# EAGLE design Data_Over_Power_Breakout (EAGLE 6.5.0)
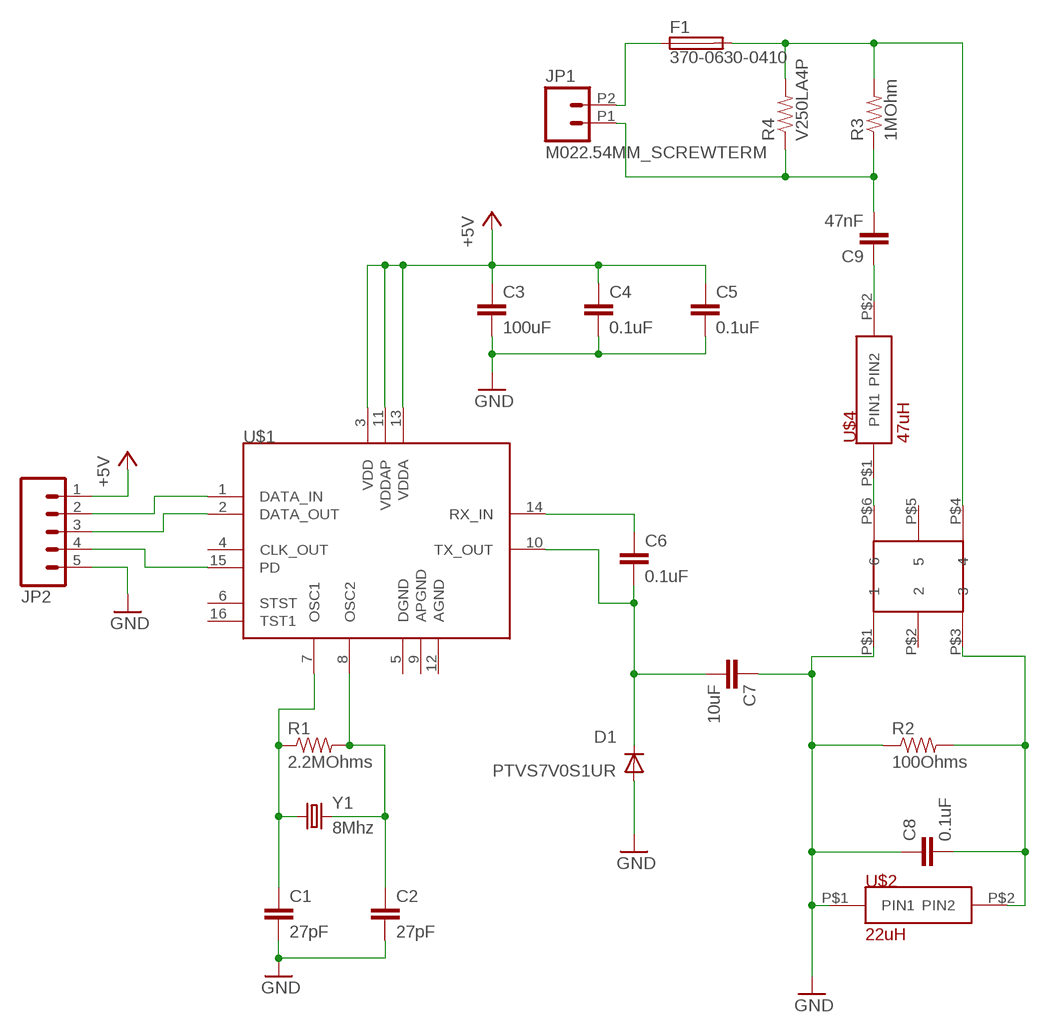
[diagram p0: schematic, sheet 1]

## Parts
C1  27pF  CAP1206  [1206]
C2  27pF  CAP1206  [1206]
C3  100uF  CAP1206  [1206]
C4  0.1uF  CAP1206  [1206]
C5  0.1uF  CAP1206  [1206]
C6  0.1uF  CAP_  [AXIAL-5MM]
C7  10uF  CAPPTH  [CAP-PTH-SMALL]
C8  0.1uF  CAP1206  [1206]
C9  47nF  C15/5  [C15B5]
D1  PTVS7V0S1UR  CGRM4001-G  [SOD-123_MINI-SMA]
F1  370-0630-0410  TR5  [TR5]
JP1  M022.54MM_SCREWTERM  [1X02_2.54_SCREWTERM]
JP2  M05PTH_LONGPADS  [1X05_LONGPADS]
R1  2.2MOhms  RESISTOR1206  [1206]
R2  100Ohms  RESISTORPTH-1/2W  [AXIAL-0.5]
R3  1MOhm  10KOHM1/6W5%(PTH)KIT  [AXIAL-0.3-KIT]
R4  V250LA4P  RESISTORPTH-1/4W  [AXIAL-0.4]
U$1  TDA5052AT  [SO16L]
U$2  22uH  RFB0807-220L  [RFB0807-220L]
U$3  78250MC  [78250MC]
U$4  47uH  RFB0807-220L  [RFB0807-220L]
Y1  8Mhz  CRYSTALHC49US  [HC49US]

## Nets
+5V: C3.1 C4.1 C5.1 JP2.1 U$1.3(VDD) U$1.11(VDDAP) U$1.13(VDDA)
GND: C1.2 C2.2 C3.2 C4.2 C5.2 C7.1 C8.1 D1.A JP2.5 R2.P$1 U$2.P$1(PIN1) U$3.P$1
N$1: C2.1 R1.2 U$1.8(OSC2) Y1.2
N$2: C1.1 R1.1 U$1.7(OSC1) Y1.1
N$3: U$3.P$6 U$4.P$1(PIN1)
N$4: C8.2 R2.P$2 U$2.P$2(PIN2) U$3.P$3
N$5: C6.P$1 U$1.14(RX_IN)
N$6: C6.P$2 C7.2 D1.C U$1.10(TX_OUT)
N$7: C9.1 U$4.P$2(PIN2)
N$8: C9.2 JP1.P1 R3.P$1 R4.P$1
N$9: F1.2 R3.P$2 R4.P$2 U$3.P$4
N$10: F1.1 JP1.P2
N$11: JP2.2 U$1.1(DATA_IN)
N$12: JP2.3 U$1.2(DATA_OUT)
N$13: JP2.4 U$1.15(PD)
Unconnected: U$1.4(CLK_OUT) U$1.5(DGND) U$1.6(STST) U$1.9(APGND) U$1.12(AGND) U$1.16(TST1) U$3.P$2 U$3.P$5

## Library data of the parts
C1-C6 C8 = SparkFun-Passives:CAP: Capacitor Standard 0603 ceramic capacitor, and 0.1" leaded capacitor.
C7 = SparkFun-Capacitors:CAP: Capacitor Standard 0603 ceramic capacitor, and 0.1" leaded capacitor.
C9 = capacitor-wima:C: CAPACITOR naming: grid - package width
D1 = diode:CGRM400*-G: Molded plasitc,JEDEC SOD-123/Mini SMA Source: Comchip CGRM4001-G.pdf
F1 = fuse:TR5: FUSE Wickmann; OC_FARNELL: unknown; OC_NEWARK: unknown
JP1 = SparkFun-Connectors:M02: Standard 2-pin 0.1" header. Use with - straight break away headers ( PRT-00116) - right angle break away headers (PRT-00553) - swiss pins (PRT-00743) - machine pins (PRT-00117) - female headers (PRT-00115) Molex polarized connector foot print use with: PRT-08233 with associated crimp pins and housings. 2.54_SCREWTERM for use with PRT-10571. 3.5mm Screw Terminal footprints for PRT-08084 5mm Screw Terminal footprints for use with PRT-08433
JP2 = SparkFun-Connectors:M05: Header 5 Standard 5-pin 0.1" header. Use with straight break away headers (SKU : PRT-00116), right angle break away headers (PRT-00553), swiss pins (PRT-00743), machine pins (PRT-00117), and female headers (PRT-00115). Molex polarized connector foot print use with SKU : PRT-08230 with associated crimp pins and housings.
R1 R4 = SparkFun-Passives:RESISTOR: Resistor Basic schematic elements and footprints for 0603, 1206, and PTH resistors.
R2 = SparkFun-Resistors:RESISTOR: Resistor Basic schematic elements and footprints for 0603, 1206, and PTH resistors.
R3 = SparkFun-Resistors:10KOHM1/6W5%(PTH): RES-08375; PROD_ID: RES-08375
U$1 = Power_Modem:TDA5052AT
U$2 U$4 = Coilcraft_Inductors:RFB0807-220L
U$3 = Murata_Transformers:78250MC
Y1 = SparkFun-FreqCtrl:CRYSTAL: Various standard crystals. Proven footprints. Spark Fun Electronics SKU : COM-00534

## Board
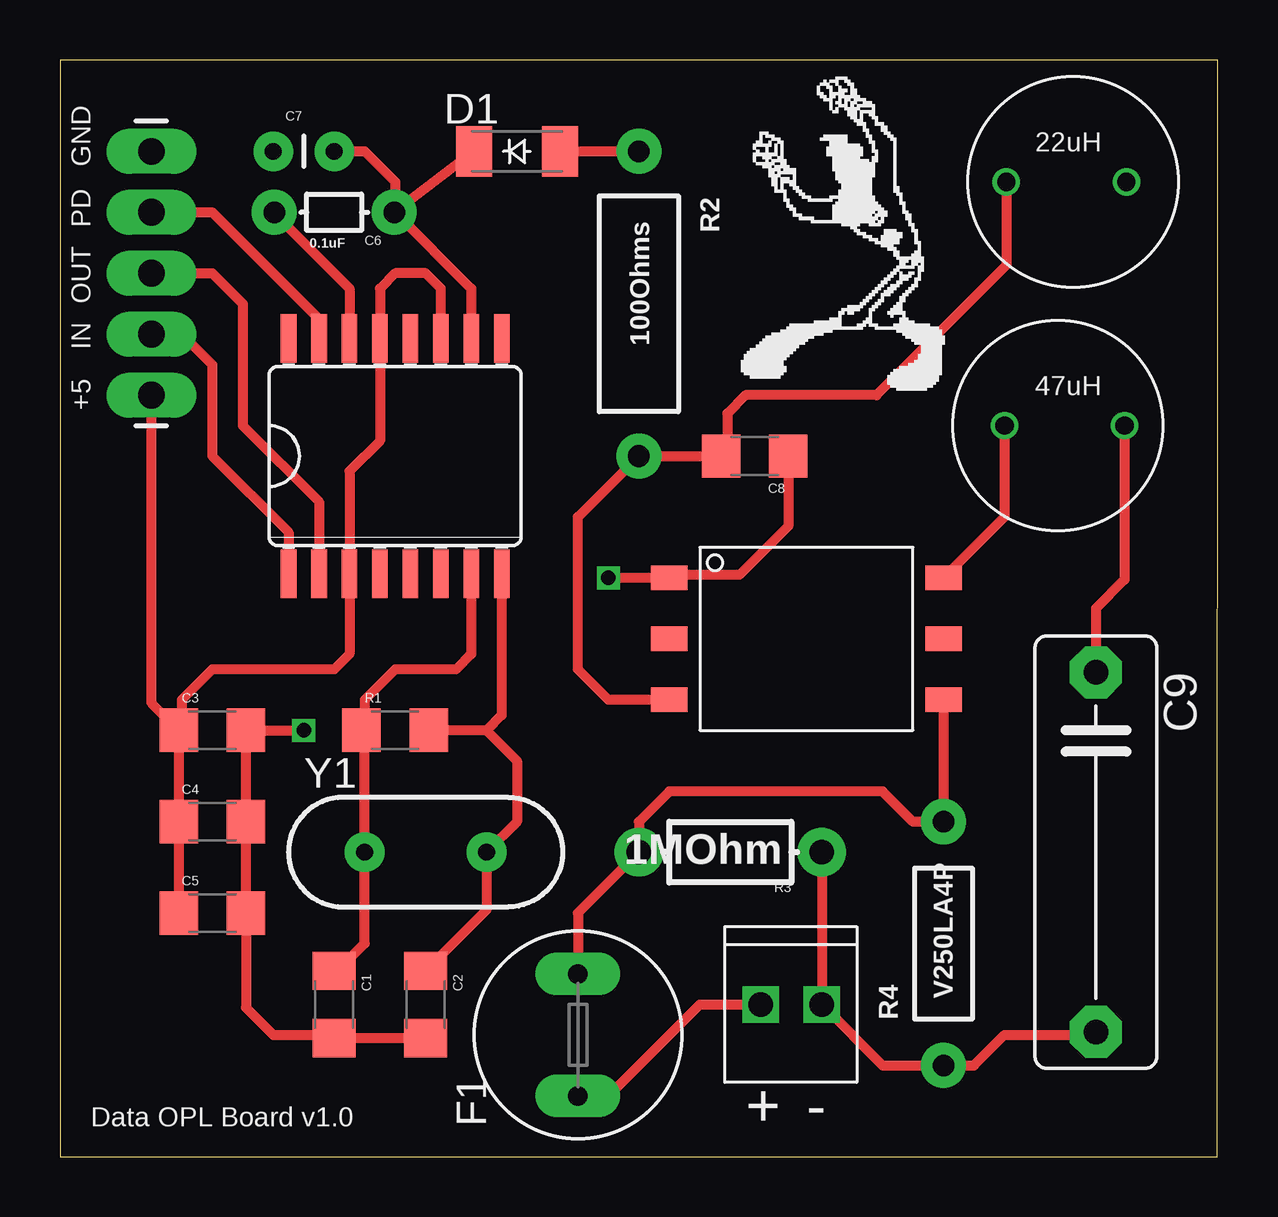
[diagram p1: board, top side]
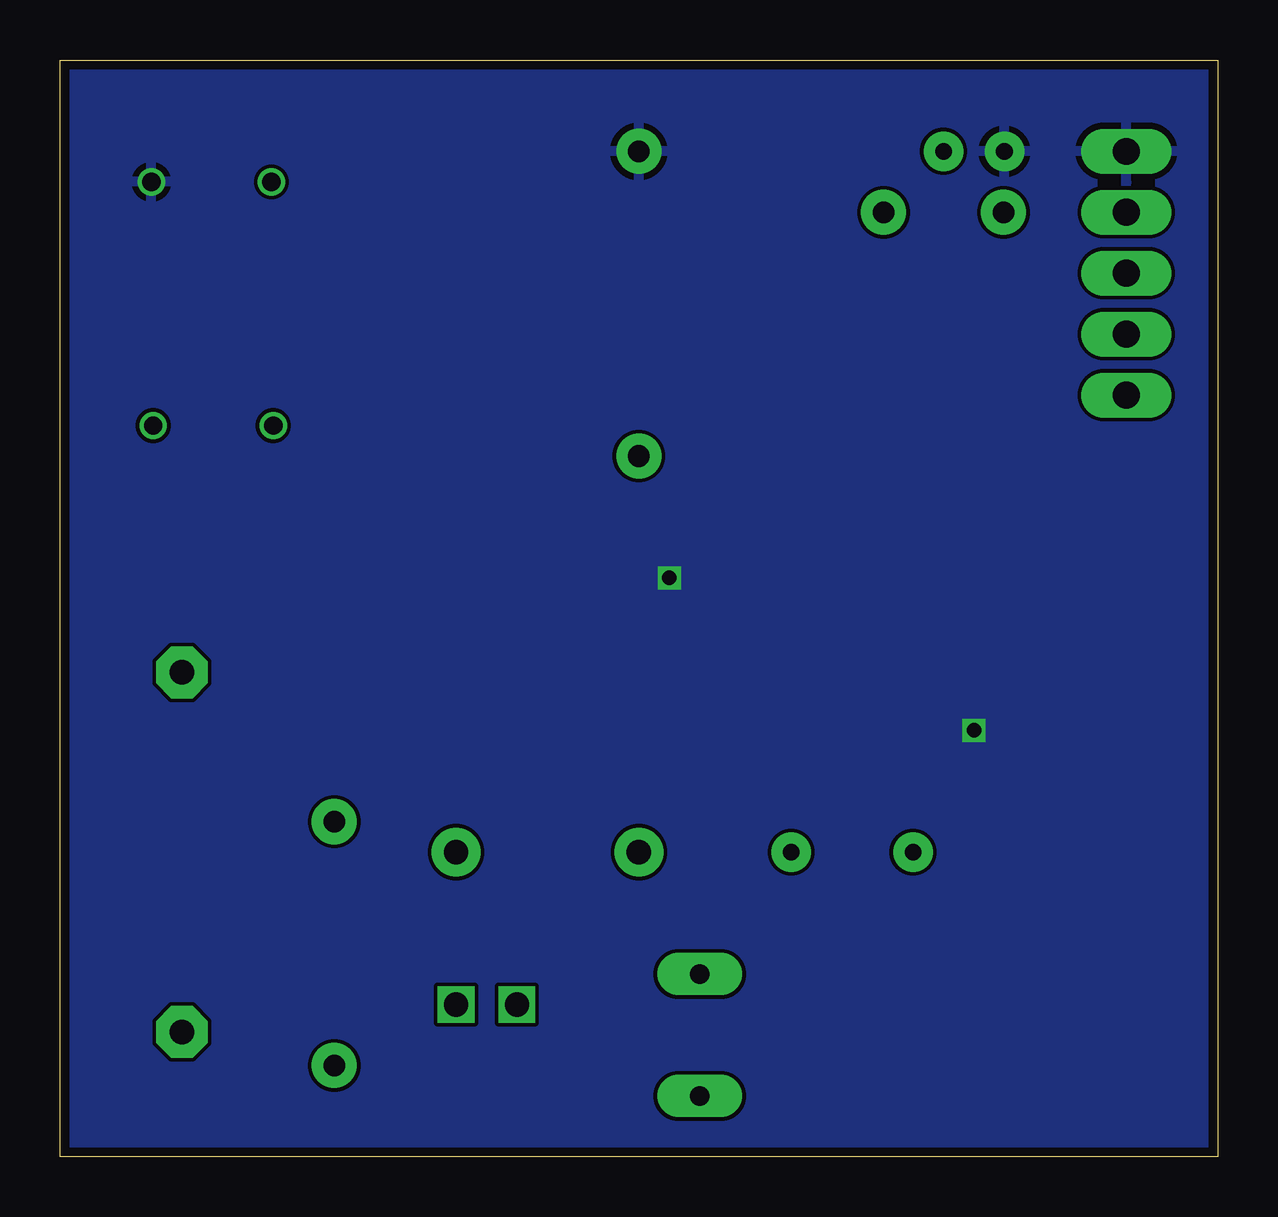
[diagram p2: board, bottom side, seen from below]

Size 48.26 x 45.72 mm. Coordinates in mm from the lower left corner, seen from the top.
Outline: 0,0 48.24,0 48.26,45.72 0,45.72 0,0
Copper layers (1*16): Top 0.0356mm / dielectric 1.5011mm / Bottom 0.0356mm
Design rules "OSH_PARK_DRC": minimum track width 6mil, minimum drill 13mil, track to track 6mil, track to pad 6mil, pad to pad 6mil, via to via 6mil, smd to smd 6mil, copper to edge 15mil, drill to drill 6mil, minimum pad ring 7mil, minimum via ring 7mil, stop-mask expansion 3mil, vias tented up to drill 0mil, thermal gap 10mil

### Footprints (pad centres in the part's own frame; a part is rotated, then mirrored left to right if it is on the bottom)
1206 = smd 1.6 x 1.8: 1 -1.4,0; 2 1.4,0
AXIAL-5MM = drill 0.9 pad 1.88: P$1 -2.5,0; P$2 2.5,0
CAP-PTH-SMALL = drill 0.7 pad 1.651: 1 0,0; 2 2.54,0
C15B5 = drill 1.016 pad 2.159 octagon: 1 -7.493,0; 2 7.493,0
SOD-123_MINI-SMA = smd 1.5 x 2.1: A 1.8,0; C -1.8,0
TR5 = drill 0.813 pad 1.778 long: 1 -2.54,0; 2 2.54,0
1X02_2.54_SCREWTERM = drill 1.016 square: P1 2.54,0; P2 0,0
1X05_LONGPADS = drill 1.118 pad 1.88 long: 1 0,0; 2 2.54,0; 3 5.08,0; 4 7.62,0; 5 10.16,0
AXIAL-0.5 = drill 0.9 pad 1.88: P$1 -6.35,0; P$2 6.35,0
AXIAL-0.3-KIT = drill 1.016 pad 2.032: P$1 -3.81,0; P$2 3.81,0
AXIAL-0.4 = drill 0.9 pad 1.88: P$1 -5.08,0; P$2 5.08,0
SO16L = smd 0.66 x 2.032: 1 -4.445,-4.902; 2 -3.175,-4.902; 3 -1.905,-4.902; 4 -0.635,-4.902; 5 0.635,-4.902; 6 1.905,-4.902; 7 3.175,-4.902; 8 4.445,-4.902; 9 4.445,4.902; 10 3.175,4.902; 11 1.905,4.902; 12 0.635,4.902; 13 -0.635,4.902; 14 -1.905,4.902; 15 -3.175,4.902; 16 -4.445,4.902
RFB0807-220L = drill 0.762: P$1 0,0; P$2 5.004,0
78250MC = smd 1.524 x 1.016: P$1 0,0; P$2 0,-2.54; P$3 0,-5.08; P$4 11.43,-5.08; P$5 11.43,-2.54; P$6 11.43,0
HC49US = drill 0.7 pad 1.651: 1 -2.54,0; 2 2.54,0

### Placement (x,y rotation side)
C1  11.43,6.35 270 top
C2  15.24,6.35 270 top
C3  6.35,17.78 0 top
C4  6.35,13.97 0 top
C5  6.35,10.16 0 top
C6  11.43,39.37 0 top
C7  8.89,41.91 0 top
C8  28.96,29.21 180 top
C9  43.18,12.7 270 top
D1  19.05,41.91 0 top
F1  21.59,5.08 90 top
JP1  29.21,6.35 0 top
JP2  3.81,31.75 90 top
R1  13.97,17.78 0 top
R2  24.13,35.56 270 top
R3  27.94,12.7 180 top
R4  36.83,8.89 90 top
U$1  13.97,29.21 0 top
U$2  44.45,40.64 180 top
U$3  25.4,24.13 0 top
U$4  39.37,30.48 0 top
Y1  15.24,12.7 0 top

### Tracks (layer width: path | path; a pad name or v marks a point on that pad's centre or on a via)
+5V
  Top 0.406: C3.1 C4.1 C5.1 | C3.1 5.08,17.91 5.08,19.05 6.35,20.32 11.43,20.32 12.06,20.95 U$1.3 12.06,28.57 13.34,29.84 U$1.13 13.34,36.2 13.97,36.83 15.24,36.83 15.88,36.2 U$1.11 | JP2.1 3.81,18.92 C3.1
GND  (via drill 0.6)
  Top 0.406: C2.2 C1.2 11.3,5.08 8.89,5.08 7.75,6.22 C5.2 C4.2 C3.2 v10.16,17.78 | v22.86,24.13 U$3.P$1 25.53,24.26 28.32,24.26 30.36,26.29 C8.1 | D1.A R2.P$1
  pour Bottom: 0,0 48.26,0 48.26,45.72 0,45.72
N$1
  Top 0.406: U$1.8 18.41,18.41 17.78,17.78 | 17.78,17.78 R1.2 | 17.78,17.78 19.05,16.51 19.05,13.97 Y1.2 17.78,10.29 C2.1
N$2
  Top 0.406: U$1.7 17.14,20.95 16.51,20.32 13.97,20.32 12.7,19.05 12.7,17.91 R1.1 12.7,17.65 Y1.1 12.7,8.89 11.56,7.75 C1.1
N$3
  Top 0.406: U$4.P$1 39.37,26.67 U$3.P$6
N$4
  Top 0.406: U$3.P$3 22.86,19.05 21.59,20.32 21.59,26.67 R2.P$2 C8.2 27.81,29.47 27.81,30.99 28.57,31.75 34.04,31.75 39.45,37.16 U$2.P$2
N$5
  Top 0.406: C6.P$1 8.93,39.33 12.06,36.2 U$1.14
N$6
  Top 0.406: C7.2 12.7,41.91 13.97,40.64 13.97,39.41 C6.P$2 | C6.P$2 13.97,39.37 17.14,36.2 U$1.10 | D1.C C6.P$2
N$7
  Top 0.406: U$4.P$2 44.37,24.05 43.18,22.86 C9.1
N$8
  Top 0.406: R3.P$1 JP1.P1 34.29,3.81 R4.P$1 38.1,3.81 39.37,5.08 43.05,5.08 C9.2
N$9
  Top 0.406: F1.2 21.59,10.16 R3.P$2 24.13,13.97 25.4,15.24 34.29,15.24 35.56,13.97 R4.P$2 U$3.P$4
N$10
  Top 0.406: F1.1 22.86,2.54 26.67,6.35 JP1.P2
N$11
  Top 0.406: JP2.2 5.08,34.29 6.35,33.02 6.35,29.21 9.53,26.04 U$1.1
N$12
  Top 0.406: JP2.3 6.35,36.83 7.62,35.56 7.62,30.48 10.79,27.3 U$1.2
N$13
  Top 0.406: JP2.4 6.35,39.37 10.79,34.92 U$1.15

### Text on the board
tPlace: 22uH | GND | PD | OUT | IN | 47uH | +5 | Data OPL Board v1.0 | + | -